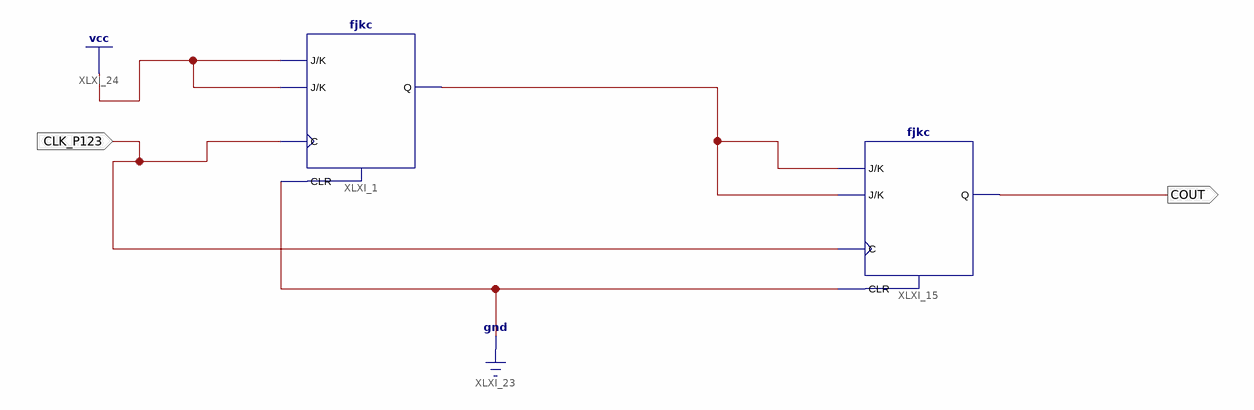
[diagram p0: schematic sheet 1]
// Xilinx ISE schematic DIV.sch (spartan6) as structural Verilog: 2 symbols, 2 ports
module DIV (
  input  CLK_P123,
  output COUT
);

  wire XLXN_24;

  fjkc XLXI_1 (.C(CLK_P123), .CLR(1'b0), .J(1'b1), .K(1'b1), .Q(XLXN_24));
  fjkc XLXI_15 (.C(CLK_P123), .CLR(1'b0), .J(XLXN_24), .K(XLXN_24), .Q(COUT));
endmodule
